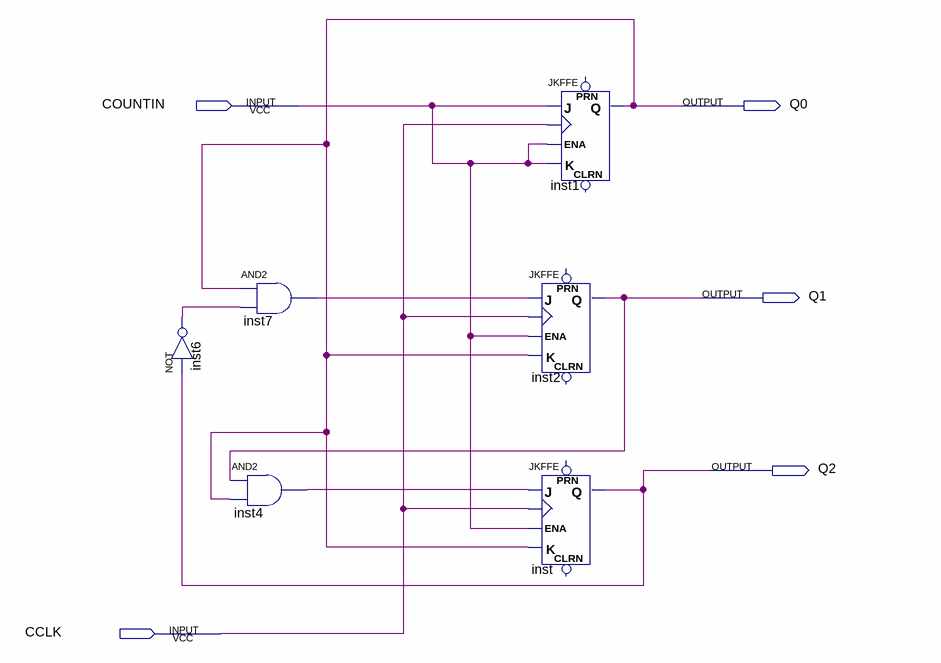
[diagram p0: schematic sheet]
// Quartus schematic MOD6.bdf as structural Verilog: 6 symbols, 5 pins
module MOD6 (
  input  COUNTIN,
  input  CCLK,
  output Q0,
  output Q1,
  output Q2
);

  wire inst4_out, inst6_out, inst7_out;

  not inst6 (inst6_out, Q2);
  and inst7 (inst7_out, Q0, inst6_out);
  and inst4 (inst4_out, Q1, Q0);
  JKFFE inst1 (.J(COUNTIN), .CLK(CCLK), .K(COUNTIN), .ENA(COUNTIN), .Q(Q0));  // open: PRN, CLRN
  JKFFE inst2 (.J(inst7_out), .CLK(CCLK), .K(Q0), .ENA(COUNTIN), .Q(Q1));  // open: PRN, CLRN
  JKFFE inst (.J(inst4_out), .CLK(CCLK), .K(Q0), .ENA(COUNTIN), .Q(Q2));  // open: PRN, CLRN
endmodule
